# Altium schematic sheet MCU.SchDoc
size B; SheetNumber: 5; SheetTotal: 11
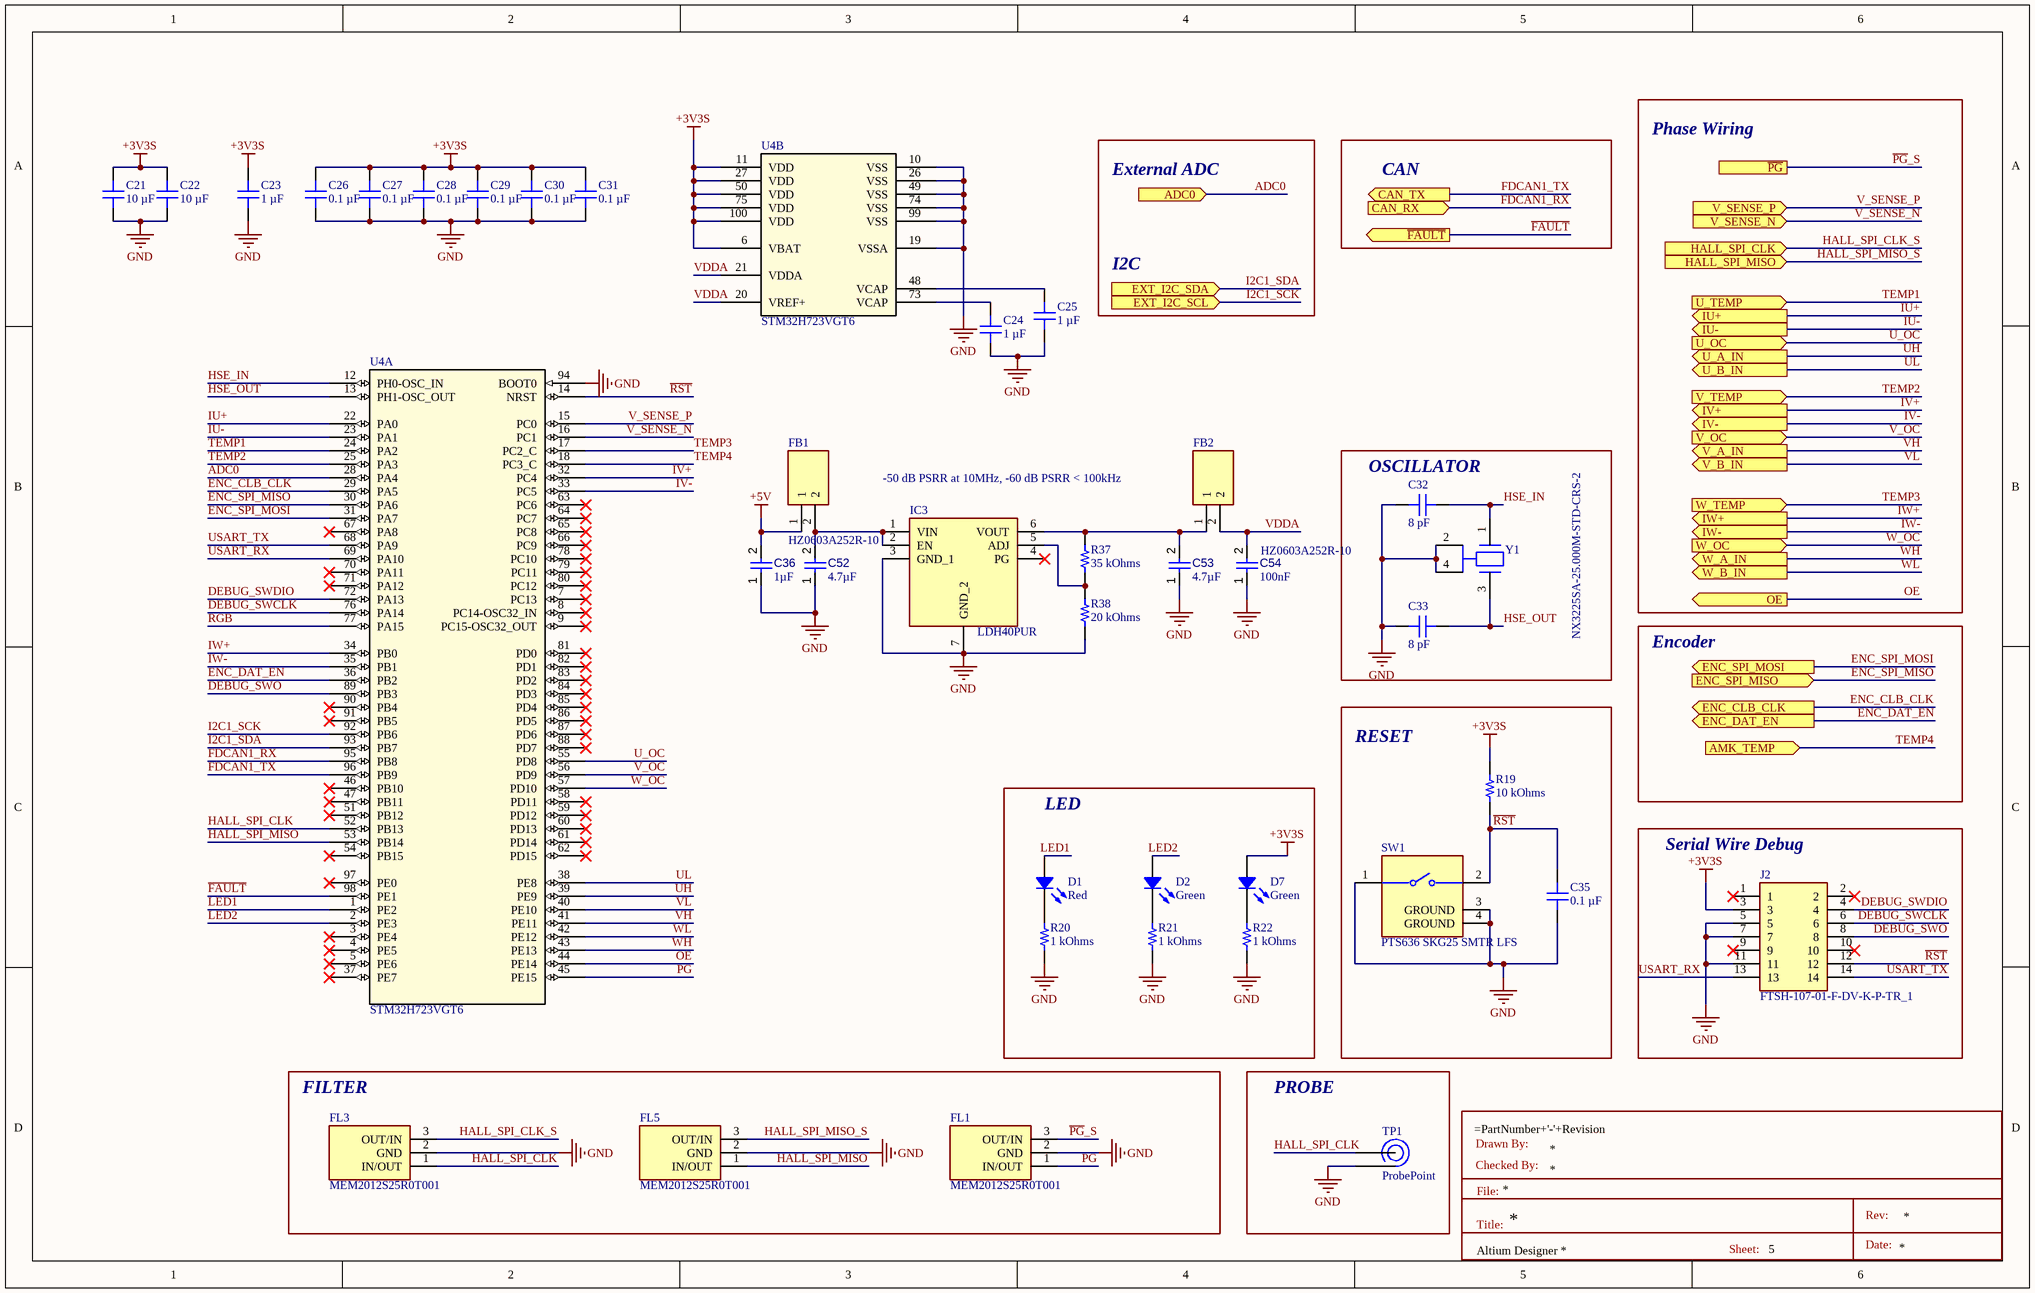
[diagram p0: MCU.SchDoc]

## Parts
C21  10 µF  [CAP 0402_1005]
C22  10 µF  [CAP 0402_1005]
C23  1 µF  [MURATA GRM155 0402_1005]
C24  1 µF  [MURATA GRM155 0402_1005]
C25  1 µF  [MURATA GRM155 0402_1005]
C26  0.1 µF  [CAP 0402_1005]
C27  0.1 µF  [CAP 0402_1005]
C28  0.1 µF  [CAP 0402_1005]
C29  0.1 µF  [CAP 0402_1005]
C30  0.1 µF  [CAP 0402_1005]
C31  0.1 µF  [CAP 0402_1005]
C32  8 pF  [CAP 0402_1005]
C33  8 pF  [CAP 0402_1005]
C35  0.1 µF  [CAP 0402_1005]
C36  value 1µF  [CAPC0402(1005)60_L]  (hidden comment: Capacitor 1µF +/-20% 10V 0402)
C52  value 4.7µF  [CAPC0402(1005)60_L]  (hidden comment: Capacitor 1µF +/-20% 10V 0402)
C53  value 4.7µF  [CAPC0402(1005)60_L]  (hidden comment: Capacitor 1µF +/-20% 10V 0402)
C54  value 100nF  [CAPC0402(1005)60_L]  (hidden comment: Capacitor 100nF +/-20% 25V 0402)
D1  Red  [LED 0603_1608 RED]
D2  Green  [LED 0603_1608 GREEN]
D7  Green  [LED 0603_1608 GREEN]
FB1  HZ0603A252R-10  [BEADC1608X95N]
FB2  HZ0603A252R-10  [BEADC1608X95N]
FL1  MEM2012S25R0T001  [MEM2012S25R0T001]
FL3  MEM2012S25R0T001  [MEM2012S25R0T001]
FL5  MEM2012S25R0T001  [MEM2012S25R0T001]
IC3  LDH40PUR  [SON65P200X200X80-7N]
J2  FTSH-107-01-F-DV-K-P-TR_1  [FTSH-107-XX-YYY-DV-K-P-TR]
R19  10 kOhms  [RES 0402_1005]
R20  1 kOhms  [RES 0402_1005]
R21  1 kOhms  [RES 0402_1005]
R22  1 kOhms  [RES 0402_1005]
R37  35 kOhms  [RES 0402_1005]
R38  20 kOhms  [RES 0402_1005]
SW1  PTS636 SKG25 SMTR LFS  [FP-PTS636_SKG25_SMTR_LFS-MFG]
TP1  ProbePoint  [ProbePoint]
U4  STM32H723VGT6  [LQFP100_STM]  (parts A,B of 2)
Y1  NX3225SA-25.000M-STD-CRS-2  [FP-NX3225SA-MFG]

## Blocks framed on the sheet
OSCILLATOR: C32 C33 Y1
RESET: C35 R19 SW1
LED: D1 D2 D7 R20-R22
Serial Wire Debug: J2
FILTER: FL1 FL3 FL5
PROBE: TP1

## Ports
ADC0 (in), AMK_TEMP (in), CAN_RX (in), CAN_TX (out), ENC_CLB_CLK (out), ENC_DAT_EN (out), ENC_SPI_MISO (in), ENC_SPI_MOSI (out), EXT_I2C_SCL (in), EXT_I2C_SDA (in), HALL_SPI_CLK (in), HALL_SPI_MISO (in), IU+ (out), IU- (out), IV+ (out), IV- (out), IW+ (out), IW- (out), OE (out), U_A_IN (out), U_B_IN (out), U_OC (in), U_TEMP (in), V_A_IN (out), V_B_IN (out), V_OC (in), V_SENSE_N (in), V_SENSE_P (in), V_TEMP (in), W_A_IN (out), W_B_IN (out), W_OC (in), W_TEMP (in), ~{FAULT} (out), ~{PG}

## Nets
+3V3S: C21.2 C22.2 C23.2 C26.2 C27.2 C28.2 C29.2 C30.2 C31.2 D7.1 J2.3 R19.2 U4.6(VBAT) U4.11(VDD) U4.27(VDD) U4.50(VDD) U4.75(VDD) U4.100(VDD)
+5V: C36.2 FB1.1
GND: C21.1 C22.1 C23.1 C24.1 C25.1 C26.1 C27.1 C28.1 C29.1 C30.1 C31.1 C32.2 C33.2 C35.1 C36.1 C52.1 C53.1 C54.1 FL1.2(GND) FL3.2(GND) FL5.2(GND) IC3.3(GND_1) IC3.7(GND_2) J2.5 J2.7 J2.11 R20.1 R21.1 R22.1 R38.2 SW1.1 SW1.3(GROUND) SW1.4(GROUND) TP1.2 U4.10(VSS) U4.19(VSSA) U4.26(VSS) U4.49(VSS) U4.74(VSS) U4.94(BOOT0) U4.99(VSS) Y1.2(GND) Y1.4(GND)
ADC0: U4.28(PA4) ; port ADC0
DEBUG_SWCLK: J2.6 U4.76(PA14)
DEBUG_SWDIO: J2.4 U4.72(PA13)
DEBUG_SWO: J2.8 U4.89(PB3)
ENC_CLB_CLK: U4.29(PA5) ; port ENC_CLB_CLK
ENC_DAT_EN: U4.36(PB2) ; port ENC_DAT_EN
ENC_SPI_MISO: U4.30(PA6) ; port ENC_SPI_MISO
ENC_SPI_MOSI: U4.31(PA7) ; port ENC_SPI_MOSI
~{FAULT}: U4.98(PE1) ; port ~{FAULT}
FDCAN1_RX: U4.95(PB8) ; port CAN_RX
FDCAN1_TX: U4.96(PB9) ; port CAN_TX
HALL_SPI_CLK: FL3.1(IN/OUT) TP1.1 U4.52(PB13)
HALL_SPI_CLK_S: FL3.3(OUT/IN) ; port HALL_SPI_CLK
HALL_SPI_MISO: FL5.1(IN/OUT) U4.53(PB14)
HALL_SPI_MISO_S: FL5.3(OUT/IN) ; port HALL_SPI_MISO
HSE_IN: C32.1 U4.12(PH0-OSC_IN) Y1.1
HSE_OUT: C33.1 U4.13(PH1-OSC_OUT) Y1.3
I2C1_SCK: U4.92(PB6) ; port EXT_I2C_SCL
I2C1_SDA: U4.93(PB7) ; port EXT_I2C_SDA
IU+: U4.22(PA0) ; port IU+
IU-: U4.23(PA1) ; port IU-
IV+: U4.32(PC4) ; port IV+
IV-: U4.33(PC5) ; port IV-
IW+: U4.34(PB0) ; port IW+
IW-: U4.35(PB1) ; port IW-
LED1: D1.1 U4.1(PE2)
LED2: D2.1 U4.2(PE3)
OE: U4.44(PE14) ; port OE
~{PG}: FL1.1(IN/OUT) U4.45(PE15)
~{PG}_S: FL1.3(OUT/IN) ; port ~{PG}
~{RST}: C35.2 J2.12 R19.1 SW1.2 U4.14(NRST)
RGB: U4.77(PA15)
TEMP1: U4.24(PA2) ; port U_TEMP
TEMP2: U4.25(PA3) ; port V_TEMP
TEMP3: U4.17(PC2_C) ; port W_TEMP
TEMP4: U4.18(PC3_C) ; port AMK_TEMP
U_OC: U4.55(PD8) ; port U_OC
UH: U4.39(PE9) ; port U_A_IN
UL: U4.38(PE8) ; port U_B_IN
USART_RX: J2.13 U4.69(PA10)
USART_TX: J2.14 U4.68(PA9)
V_OC: U4.56(PD9) ; port V_OC
V_SENSE_N: U4.16(PC1) ; port V_SENSE_N
V_SENSE_P: U4.15(PC0) ; port V_SENSE_P
VDDA: C54.2 FB2.2 U4.20(VREF+) U4.21(VDDA)
VH: U4.41(PE11) ; port V_A_IN
VL: U4.40(PE10) ; port V_B_IN
W_OC: U4.57(PD10) ; port W_OC
WH: U4.43(PE13) ; port W_A_IN
WL: U4.42(PE12) ; port W_B_IN
NetC24_2: C24.2 U4.73(VCAP)
NetC25_2: C25.2 U4.48(VCAP)
NetC52_2: C52.2 FB1.2 IC3.1(VIN) IC3.2(EN)
NetC53_2: C53.2 FB2.1 IC3.6(VOUT) R37.1
NetD1_2: D1.2 R20.2
NetD2_2: D2.2 R21.2
NetD7_2: D7.2 R22.2
NetIC3_5: IC3.5(ADJ) R37.2 R38.1

Not connected (* = marked no-connect by the designer): IC3 4(PG)*; J2 1* 2* 9* 10*; U4 3(PE4)* 4(PE5)* 5(PE6)* 7(PC13)* 8(PC14-OSC32_IN)* 9(PC15-OSC32_OUT)* 37(PE7)* 46(PB10)* 47(PB11)* 51(PB12)* 54(PB15)* 58(PD11)* 59(PD12)* 60(PD13)* 61(PD14)* 62(PD15)* 63(PC6)* 64(PC7)* 65(PC8)* 66(PC9)* 67(PA8)* 70(PA11)* 71(PA12)* 78(PC10)* 79(PC11)* 80(PC12)* 81(PD0)* 82(PD1)* 83(PD2)* 84(PD3)* 85(PD4)* 86(PD5)* 87(PD6)* 88(PD7)* 90(PB4)* 91(PB5)* 97(PE0)*

## Notes on the sheet
- Phase Wiring
- External ADC
- CAN
- I2C
- -50 dB PSRR at 10MHz, -60 dB PSRR < 100kHz
- Encoder
- Drawn By:
- Checked By:
- File:
- Title:
- Sheet:
- Rev:
- Date:

## Library data of the parts
C21 C22 = CL05A106MP8NUB8: CAP CER 10UF 10V X5R 0402; manufacturer: Samsung Electro-Mechanics; Tolerance: ±20%; Part Number: CL05A106MP8NUB8; Capacitance: 10 µF; Applications: Acoustic Noise Reduction; componentlink1description: Datasheet; componentlink1url: http://www.samsungsem.com/kr/support/product-search/mlcc/CL05A106MP8NUB8.jsp; componentlink2description: DigiKey Link; componentlink2url: https://www.digikey.com/en/products/detail/samsung-electro-mechanics/CL05A106MP8NUB8/5961314; Device Package: 0402 (1005 Metric); lastupdated: 2/9/2024 8:04:38 PM; Lifecycle Status: Active; Minimum Order: 1; Mounting Type: Surface Mount, MLCC; Operating Temperature: -55°C ~ 85°C; Package / Case: 0402 (1005 Metric); packaging: TapeAndReel; partid: 1758; Part Status: Active; price: 0.06; series: CL; Size / Dimension: 0.039" L x 0.020" W (1.00mm x 0.50mm); Supplier 1: DigiKey; Supplier Part Number 1: 1276-6830-1-ND; Temperature Coefficient: X5R; Thickness (Max): 0.035" (0.90mm); value: 10 µF; Voltage - Rated: 10V
C23-C25 = GRM155C71A105KE11D: CAP CER 1UF 10V X7S 0402; manufacturer: Murata Electronics; Tolerance: ±10%; Part Number: GRM155C71A105KE11D; Capacitance: 1 µF; Applications: General Purpose; componentlink1description: Datasheet; componentlink1url: https://search.murata.co.jp/Ceramy/image/img/A01X/G101/ENG/GRM155C71A105KE11-01.pdf; componentlink2description: DigiKey Link; componentlink2url: https://www.digikey.com/en/products/detail/murata-electronics/GRM155C71A105KE11D/6606086; Device Package: 0402 (1005 Metric); lastupdated: 7/23/2025 10:42:36 AM; Lifecycle Status: Active; Minimum Order: 1; Mounting Type: Surface Mount, MLCC; Operating Temperature: -55°C ~ 125°C; Package / Case: 0402 (1005 Metric); packaging: TapeAndReel; partid: 1749; Part Status: Active; price: 0.01; series: GRM; Size / Dimension: 0.039" L x 0.020" W (1.00mm x 0.50mm); Supplier 1: DigiKey; Supplier Part Number 1: 490-14457-1-ND; Temperature Coefficient: X7S; Thickness (Max): 0.024" (0.60mm); value: 1 µF; Voltage - Rated: 10V
C26-C31 C35 = C0402C104K4RECAUTO: CAP CER 0402 0.1UF 16V X7R 10%; manufacturer: KEMET; Part Number: C0402C104K4RECAUTO; Capacitance: 0.1 µF; Applications: Automotive, ESD Protection; componentlink1description: Datasheet; componentlink1url: https://api.kemet.com/component-edge/download/datasheet/C0402C104K4RECAUTO.pdf; componentlink2description: DigiKey Link; componentlink2url: https://www.digikey.com/en/products/detail/kemet/C0402C104K4RECAUTO/8563695; Device Package: 0402 (1005 Metric); lastupdated: 2/9/2024 8:04:38 PM; Lifecycle Status: Active; Minimum Order: 1; Mounting Type: Surface Mount, MLCC; Operating Temperature: -55°C ~ 125°C; Package / Case: 0402 (1005 Metric); packaging: TapeAndReel; partid: 1731; Part Status: Active; price: 0.01; Ratings: AEC-Q200; series: ESD SMD Auto X7R; Size / Dimension: 0.039" L x 0.020" W (1.00mm x 0.50mm); Supplier 1: DigiKey; Supplier Part Number 1: 399-17167-1-ND; Temperature Coefficient: X7R; Thickness (Max): 0.022" (0.55mm); Tolerance: ±10%; value: 0.1 µF; Voltage - Rated: 16V
C32 C33 = HMK105CG080DV-F: CAP CER 8PF 100V C0G/NP0 0402; manufacturer: Taiyo Yuden; Temperature Coefficient: C0G, NP0; Tolerance: ±0.5pF; Part Number: HMK105CG080DV-F; Capacitance: 8 pF; Applications: General Purpose; componentlink1description: Datasheet; componentlink1url: http://www.yuden.co.jp/productdata/catalog/mlcc06_e.pdf; componentlink2description: DigiKey Link; componentlink2url: https://www.digikey.com/en/products/detail/taiyo-yuden/HMK105CG080DV-F/6563590; Device Package: 0402 (1005 Metric); lastupdated: 2/9/2024 8:04:38 PM; Lifecycle Status: Active; Minimum Order: 1; Mounting Type: Surface Mount, MLCC; Operating Temperature: -55°C ~ 125°C; Package / Case: 0402 (1005 Metric); packaging: TapeAndReel; partid: 1851; Part Status: Active; price: 0.03; series: M; Size / Dimension: 0.039" L x 0.020" W (1.00mm x 0.50mm); Supplier 1: DigiKey; Supplier Part Number 1: 587-4997-1-ND; Thickness (Max): 0.022" (0.55mm); value: 8 pF; Voltage - Rated: 100V
C36 C52 C53 = CMP-001-00063-3: Chip Capacitor, 1µF +/-20%, 10V, 0402, Thickness 0.6 mm; Tolerance: 10%; Mounting Technology: SMT; Max Operating Temperature: 85°C; Voltage Rating: 10V; Pins: 2; Case/Package: 0402; Min Operating Temperature: -55°C
C54 = CMP-001-00065-4: Chip Capacitor, 100nF +/-20%, 25V, 0402, Thickness 0.6 mm; Tolerance: 10%; Max Operating Temperature: 85°C; Min Operating Temperature: -55°C; Pins: 2; Voltage Rating: 25V; Mounting Technology: SMT; Case/Package: 0402
D1 = 5973005507F: LED RED 0603 SMD; Manufacturer: Dialight; Configuration: Standard; Current - Test: 20mA; Lens Color: 0.68mm; Lens Size: 1.20mm x 0.80mm; Lens Style: Rectangle with Flat Top; Millicandela Rating: 90mcd; Voltage - Forward (Vf) (Typ): 2V; Wavelength - Dominant: 630nm; Part Number: 5973005507F; Color: Red; ComponentLink1Description: Datasheet; ComponentLink1URL: http://www.dialightsignalsandcomponents.com/Assets/Drawings/2D_Drawings_DrawingDetailedSpec/NewDrawings/18369A.pdf; ComponentLink2Description: DigiKey Link; ComponentLink2URL: https://www.digikey.com/en/products/detail/dialight/5973005507F/9385429; Device Package: 0603 (1608 Metric); Height (Max): 0.68mm; LastUpdated: 6/3/2024 7:59:48 PM; Lifecycle Status: Active; Minimum Order: 1; Mounting Type: Surface Mount; Package / Case: 0603 (1608 Metric); Packaging: TapeAndReel; PartId: 378; Part Status: Active; Price: 0.08; Series: 597; Size / Dimension: 1.60mm L x 0.80mm W; Supplier 1: DigiKey; Supplier Part Number 1: 350-4374-1-ND; Supplier Device Package: 0603; Value: Red
D2 D7 = 5973316507F: LED GREEN 0603 SMD; Manufacturer: Dialight; Configuration: Standard; Current - Test: 20mA; Lens Color: 1.24mm; Lens Style: Round with Domed Top; Millicandela Rating: 34mcd; Voltage - Forward (Vf) (Typ): 2V; Wavelength - Dominant: 560nm; Part Number: 5973316507F; Color: Green; ComponentLink1Description: Datasheet; ComponentLink1URL: http://www.dialightsignalsandcomponents.com/Assets/Drawings/2D_Drawings_DrawingDetailedSpec/NewDrawings/C18371C.pdf; ComponentLink2Description: DigiKey Link; ComponentLink2URL: https://www.digikey.com/en/products/detail/dialight/5973316507F/9385428; Device Package: 0603 (1608 Metric); Height (Max): 1.24mm; LastUpdated: 6/3/2024 7:58:53 PM; Lifecycle Status: Active; Minimum Order: 1; Mounting Type: Surface Mount; Package / Case: 0603 (1608 Metric); Packaging: TapeAndReel; PartId: 587; Part Status: Active; Price: 0.13; Series: 597; Size / Dimension: 1.60mm L x 0.80mm W; Supplier 1: DigiKey; Supplier Part Number 1: 350-4373-1-ND; Supplier Device Package: 0603; Value: Green
FB1 FB2 = HZ0603A252R-10: Ferrite Bead; Manufacturer_Name: Laird Performance Materials; Datasheet Link: https://componentsearchengine.com/Datasheets/1/HZ0603A252R-10.pdf; Height: 0.95mm; Manufacturer_Part_Number: HZ0603A252R-10; Mouser Part Number: 875-HZ0603A252R-10; Mouser Price/Stock: https://www.mouser.co.uk/ProductDetail/Laird-Performance-Materials/HZ0603A252R-10?qs=D%252B9bHg9FvUOIwh1ifAKqqw%3D%3D
FL1 FL3 FL5 = MEM2012S25R0T001: Filter; Manufacturer_Name: TDK; Datasheet Link: https://product.tdk.com/system/files/dam/doc/product/emc/emc/3tf/catalog/3tf_commercial_signal_mem2012s_en.pdf; Height: 1mm; Manufacturer_Part_Number: MEM2012S25R0T001; Mouser Part Number: 810-MEM2012S25R0T001; Mouser Price/Stock: https://www.mouser.co.uk/ProductDetail/TDK/MEM2012S25R0T001?qs=uxmvvYJjMIvgfrdEOPTgFw%3D%3D; Arrow Part Number: MEM2012S25R0T001; Arrow Price/Stock: https://www.arrow.com/en/products/mem2012s25r0t001/tdk?region=nac
IC3 = LDH40PUR: Integrated Circuit; Manufacturer_Name: STMicroelectronics; Datasheet Link: https://www.st.com/resource/en/datasheet/ldh40.pdf; Height: 0.8mm; Manufacturer_Part_Number: LDH40PUR
J2 = FTSH-107-01-F-DV-K-P-TR_1: Connector; Manufacturer_Name: SAMTEC; Datasheet Link: http://suddendocs.samtec.com/prints/ftsh-1xx-xx-xxx-dv-xxx-xxx-mkt.pdf; Manufacturer_Part_Number: FTSH-107-01-F-DV-K-P-TR; Mouser Part Number: 200-FTSH10701FDVKPTR; Mouser Price/Stock: https://www.mouser.co.uk/ProductDetail/Samtec/FTSH-107-01-F-DV-K-P-TR?qs=%252BZP6%2F%252BtExtAI0atx6lcXTg%3D%3D; Arrow Part Number: FTSH-107-01-F-DV-K-P-TR; Arrow Price/Stock: https://www.arrow.com/en/products/ftsh-107-01-f-dv-k-p-tr/samtec?region=nac
R19 = WR04X1002FTL: RES 10K OHM 1% 1/16W 0402; Manufacturer: Walsin Technology Corporation; Power (Watts): 0.063W, 1/16W; Temperature Coefficient: ±100ppm/°C; Part Number: WR04X1002FTL; Value: 10 kOhms; ComponentLink1Description: Datasheet; ComponentLink1URL: https://www.passivecomponent.com/wp-content/uploads/chipR/ASC_WR.pdf; ComponentLink2Description: DigiKey Link; ComponentLink2URL: https://www.digikey.com/en/products/detail/walsin-technology-corporation/WR04X1002FTL/13241339; Composition: Thick Film; Device Package: 0402 (1005 Metric); Height - Seated (Max): 0.016" (0.40mm); LastUpdated: 2/9/2024 8:28:51 PM; Lifecycle Status: Active; Minimum Order: 1; Number of Terminations: 2; Operating Temperature: -55°C ~ 155°C; Package / Case: 0402 (1005 Metric); Packaging: CutTape; PartId: 67325; Part Status: Active; Price: 0.01; Resistance: 10 kOhms; Series: WR; Size / Dimension: 0.039" L x 0.020" W (1.00mm x 0.50mm); Supplier 1: DigiKey; Supplier Part Number 1: 1292-WR04X1002FTLCT-ND; Supplier Device Package: 0402; Tolerance: ±1%
R20-R22 = WR04X102 JTL: RES 1K OHM 5% 1/16W 0402; Manufacturer: Walsin Technology Corporation; Power (Watts): 0.063W, 1/16W; Temperature Coefficient: ±100ppm/°C; Part Number: WR04X102 JTL; Value: 1 kOhms; ComponentLink1Description: Datasheet; ComponentLink1URL: https://www.passivecomponent.com/wp-content/uploads/chipR/ASC_WR.pdf; ComponentLink2Description: DigiKey Link; ComponentLink2URL: https://www.digikey.com/en/products/detail/walsin-technology-corporation/WR04X102-JTL/13238927; Composition: Thick Film; Device Package: 0402 (1005 Metric); Height - Seated (Max): 0.016" (0.40mm); LastUpdated: 2/9/2024 8:28:50 PM; Lifecycle Status: Active; Minimum Order: 1; Number of Terminations: 2; Operating Temperature: -55°C ~ 155°C; Package / Case: 0402 (1005 Metric); Packaging: CutTape; PartId: 68140; Part Status: Active; Price: 0.01; Resistance: 1 kOhms; Series: WR; Size / Dimension: 0.039" L x 0.020" W (1.00mm x 0.50mm); Supplier 1: DigiKey; Supplier Part Number 1: 1292-WR04X102JTLCT-ND; Supplier Device Package: 0402; Tolerance: ±5%
R37 R38 = WR04X102 JTL: RES 1K OHM 5% 1/16W 0402; Manufacturer: Walsin Technology Corporation; Power (Watts): 0.063W, 1/16W; Resistance: 1 kOhms; Temperature Coefficient: ±100ppm/°C; Part Number: WR04X102 JTL; ComponentLink1Description: Datasheet; ComponentLink1URL: https://www.passivecomponent.com/wp-content/uploads/chipR/ASC_WR.pdf; ComponentLink2Description: DigiKey Link; ComponentLink2URL: https://www.digikey.com/en/products/detail/walsin-technology-corporation/WR04X102-JTL/13238927; Composition: Thick Film; Device Package: 0402 (1005 Metric); Height - Seated (Max): 0.016" (0.40mm); LastUpdated: 2/9/2024 8:28:50 PM; Lifecycle Status: Active; Minimum Order: 1; Number of Terminations: 2; Operating Temperature: -55°C ~ 155°C; Package / Case: 0402 (1005 Metric); Packaging: CutTape; PartId: 68140; Part Status: Active; Price: 0.01; Series: WR; Size / Dimension: 0.039" L x 0.020" W (1.00mm x 0.50mm); Supplier 1: DigiKey; Supplier Part Number 1: 1292-WR04X102JTLCT-ND; Supplier Device Package: 0402; Tolerance: ±5%
  R37: Value: 35 kOhms
  R38: Value: 20 kOhms
SW1 = CMP-10040-000025-1: TACT 6.0 X 3.5, 2.5 MM H, 250GF,
U4 = STM32H723VGT6: No Description Available; Mfr_Name: STMicroelectronics; RefDes: RefDes; Type: Type
Y1 = CMP-200220-000002-1: CRYSTAL 25.0000MHZ 8PF SMD; Manufacturer: NDK; Frequency: 25MHz; Automotive Grade: Grade 1; Esr: 100Ω; Tolerance: 15ppm; Digikey Description: CRYSTAL 25.0000MHZ 8PF SMD; Temperature Range Low: -40°C; Octopart: https://octopart.com/nx3225sa-25.000m-std-crs-2-ndk-51374293; Series: NX3225SA; Manufacturer Part Number: NX3225SA-25.000M-STD-CRS-2; ComponentLink2URL: https://www.ndk.com/images/products/catalog/c_NX3225SA-STD-CRS-2_e.pdf; Lead Free: Yes; Device Class L2: Crystals / Oscillators; ComponentLink2Description: Datasheet; Device Class L3: Crystals; Category: Crys; Device Class L1: Passive Components; Automotive: Yes; RoHS: TRUE; Load Capacitance: 8pF; Height: 0.6mm; Temperature Range High: +125°C; Package: NX3225SA; Temperature: -40°C to +125°C